# Altium project RP2350_Evaluation.PrjPcb
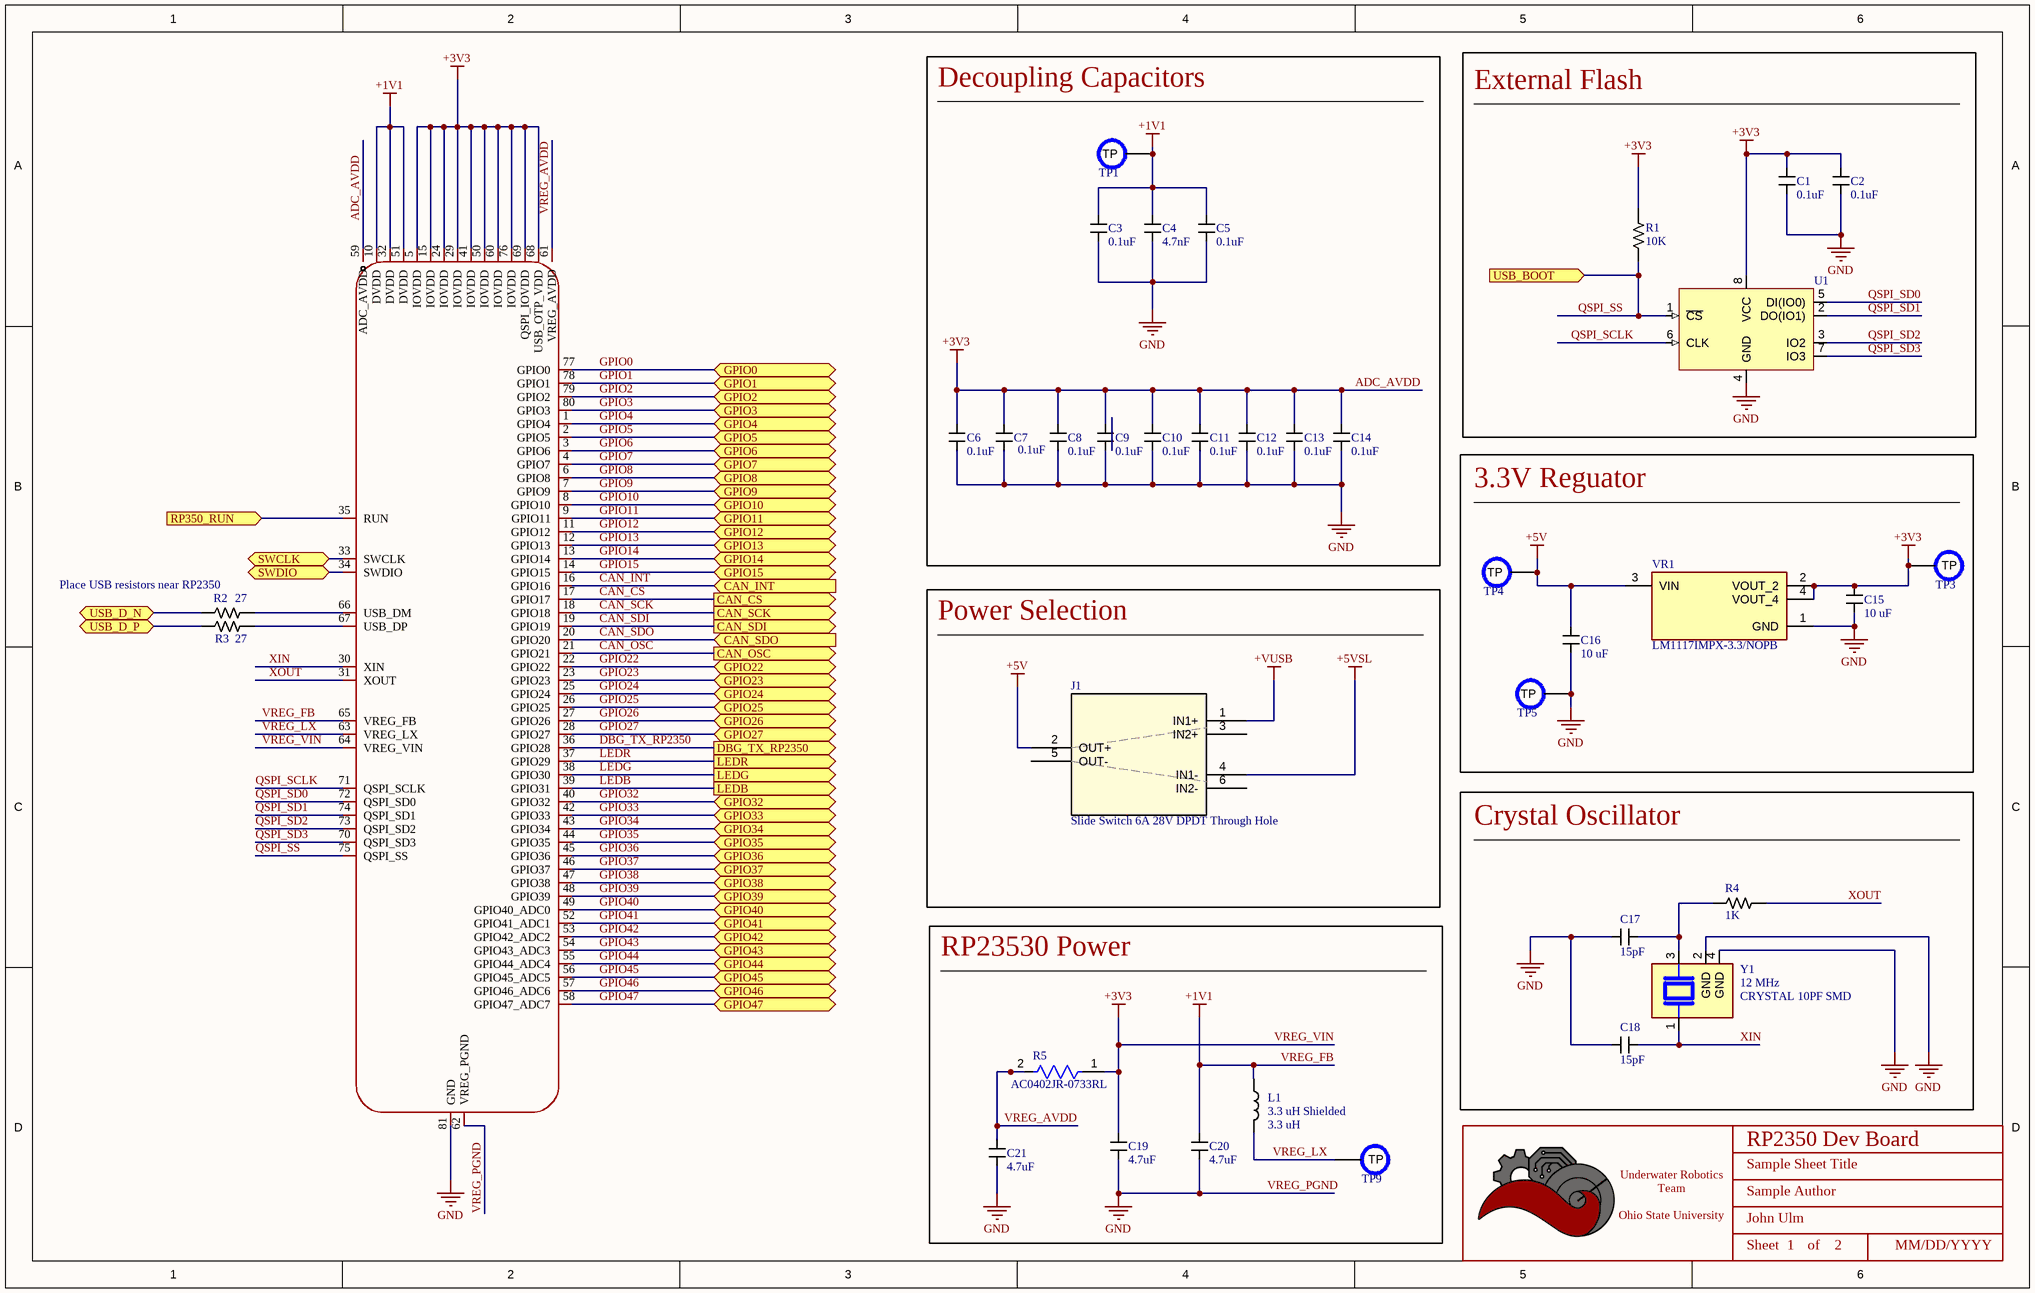
[diagram p0: Micro.SchDoc]
BoardRevision: 1.0; DateOfDesignReview: 01/01/2026; ProjectTitle: RP2350 Dev Board; TeamLead: John Ulm
2 sheets, 71 parts. Net scope: flat (ports and power ports of the same name join across sheets).
Board file: RP2350_DevBoard.PcbDoc
Sheets:
  Micro.SchDoc
  Connectors.SchDoc

## Sheet Micro.SchDoc: Sample Sheet Title
size B; Date: MM/DD/YYYY; Author: Sample Author; Organization: ORGANIZATION; Address1: ADDRESS 1; Address2: ADDRESS 2; Address3: ADDRESS 3; Address4: ADDRESS 4; Revision: -; SheetNumber: 1; SheetTotal: 2; ENG_APP_DATE: --/--/--; DSN_APP_DATE: --/--/--; CHK_APP_DATE: --/--/--

### Parts
(Parts that share a designator on the sheet are numbered #1, #2 ... from top to bottom, then left to right.)
*#1  Title_Block  [LOGO]  (value not drawn)  (graphical)
C1  value 0.1uF  [CAPACITOR_0402]  (hidden comment: 100nF Ceramic 25V)
C2  value 0.1uF  [CAPACITOR_0402]  (hidden comment: 100nF Ceramic 25V)
C3  value 0.1uF  [CAPACITOR_0402]  (hidden comment: 100nF Ceramic 25V)
C4  value 4.7nF  [CAPACITOR_0402]  (hidden comment: 4700pF Ceramic 25V)
C5  value 0.1uF  [CAPACITOR_0402]  (hidden comment: 100nF Ceramic 25V)
C6  value 0.1uF  [CAPACITOR_0402]  (hidden comment: 100nF Ceramic 25V)
C7  value 0.1uF  [CAPACITOR_0402]  (hidden comment: 100nF Ceramic 25V)
C8  value 0.1uF  [CAPACITOR_0402]  (hidden comment: 100nF Ceramic 25V)
C9  value 0.1uF  [CAPACITOR_0402]  (hidden comment: 100nF Ceramic 25V)
C10  value 0.1uF  [CAPACITOR_0402]  (hidden comment: 100nF Ceramic 25V)
C11  value 0.1uF  [CAPACITOR_0402]  (hidden comment: 100nF Ceramic 25V)
C12  value 0.1uF  [CAPACITOR_0402]  (hidden comment: 100nF Ceramic 25V)
C13  value 0.1uF  [CAPACITOR_0402]  (hidden comment: 100nF Ceramic 25V)
C14  value 0.1uF  [CAPACITOR_0402]  (hidden comment: 100nF Ceramic 25V)
C15  Value (uF): 10 uF  [CAPACITOR_0603]  (hidden comment: 10uF Ceramic 6.3V)
C16  Value (uF): 10 uF  [CAPACITOR_0603]  (hidden comment: 10uF Ceramic 6.3V)
C17  value 15pF  [CAPACITOR_0402]  (hidden comment: 15pF Ceramic 50V)
C18  value 15pF  [CAPACITOR_0402]  (hidden comment: 15pF Ceramic 50V)
C19  value 4.7uF  [CAPACITOR_0603]  (hidden comment: 4.7uF Ceramic 6.3V)
C20  value 4.7uF  [CAPACITOR_0603]  (hidden comment: 4.7uF Ceramic 6.3V)
C21  value 4.7uF  [CAPACITOR_0603]  (hidden comment: 4.7uF Ceramic 6.3V)
J1  Slide Switch 6A 28V DPDT Through Hole  [CONN_S3CQE2]
L1  3.3 uH Shielded  value 3.3 uH  [INDUCTOR_0806]
R1  Value  (Ohms): 10K  [RESISTOR_0603]  (hidden comment: 10k Ohm 0.5% 1/10W)
R2  Value  (Ohms): 27  [RESISTOR_0402]  (hidden comment: 27 Ohm 1% 1/16W)
R3  Value  (Ohms): 27  [RESISTOR_0402]  (hidden comment: 27 Ohm 1% 1/16W)
R4  Value  (Ohms): 1K  [RESISTOR_0402]  (hidden comment: 1k Ohm 1% 1/16W)
R5  AC0402JR-0733RL  [FP-AC0402-IPC_C]
TP1  PCB Test Point  [TESTPOINT_1.2MM]  (value not drawn)  (no BOM)
TP3  PCB Test Point  [TESTPOINT_1.2MM]  (value not drawn)  (no BOM)
TP4  PCB Test Point  [TESTPOINT_1.2MM]  (value not drawn)  (no BOM)
TP5  PCB Test Point  [TESTPOINT_1.2MM]  (value not drawn)  (no BOM)
TP9  PCB Test Point  [TESTPOINT_1.2MM]  (value not drawn)  (no BOM)
U1  W25Q128JVSIQ  [SOIC-8 W25QxJV]  (value not drawn)
U2  RP2350B  [QFN-80]  (value not drawn)
VR1  LM1117IMPX-3.3/NOPB  [SOT-223-4]
Y1  CRYSTAL 10PF SMD  value 12 MHz  [4-SMD, NO LEAD CRYSTAL 3.2x2.5mm]

### Blocks framed on the sheet
Decoupling Capacitors: C3-C14 TP1
External Flash: C1 C2 R1 U1
3.3V Reguator: C15 C16 TP3-TP5 VR1
Power Selection: J1
Crystal Oscillator: C17 C18 R4 Y1
RP23530 Power: C19-C21 L1 R5 TP9

### Ports
CAN_CS (out), CAN_INT (in), CAN_OSC (out), CAN_SCK (out), CAN_SDI (out), CAN_SDO (in), DBG_TX_RP2350 (out), GPIO0 (bidir), GPIO1 (bidir), GPIO2 (bidir), GPIO3 (bidir), GPIO4 (bidir), GPIO5 (bidir), GPIO6 (bidir), GPIO7 (bidir), GPIO8 (bidir), GPIO9 (bidir), GPIO10 (bidir), GPIO11 (bidir), GPIO12 (bidir), GPIO13 (bidir), GPIO14 (bidir), GPIO15 (bidir), GPIO22 (bidir), GPIO23 (bidir), GPIO24 (bidir), GPIO25 (bidir), GPIO26 (bidir), GPIO27 (bidir), GPIO32 (bidir), GPIO33 (bidir), GPIO34 (bidir), GPIO35 (bidir), GPIO36 (bidir), GPIO37 (bidir), GPIO38 (bidir), GPIO39 (bidir), GPIO40 (bidir), GPIO41 (bidir), GPIO42 (bidir), GPIO43 (bidir), GPIO44 (bidir), GPIO45 (bidir), GPIO46 (bidir), GPIO47 (bidir), LEDB (out), LEDG (out), LEDR (out), RP350_RUN (in), SWCLK (bidir), SWDIO (bidir), USB_BOOT (in), USB_D_N (bidir), USB_D_P (bidir)

### Nets
+5V: C16.1 J1.2(OUT+) TP4.TP VR1.3(VIN)
+5VSL: J1.4(IN1-)
+VUSB: J1.1(IN1+)
ADC_AVDD: C1.1 C2.1 C6.1 C7.1 C8.1 C9.1 C10.1 C11.1 C12.1 C13.1 C14.1 C15.1 C19.1 R1.1 R5.1 TP3.TP U1.8(VCC) U2.5(IOVDD) U2.15(IOVDD) U2.24(IOVDD) U2.29(IOVDD) U2.41(IOVDD) U2.50(IOVDD) U2.59(ADC_AVDD) U2.60(IOVDD) U2.64(VREG_VIN) U2.68(USB_OTP_VDD) U2.69(QSPI_IOVDD) U2.76(IOVDD) VR1.2(VOUT_2) VR1.4(VOUT_4)  [also labelled +3V3, VREG_VIN]
VREG_FB: C3.1 C4.1 C5.1 C20.2 L1.2 TP1.TP U2.10(DVDD) U2.32(DVDD) U2.51(DVDD) U2.65(VREG_FB)  [also labelled +1V1]
VREG_PGND: C1.2 C2.2 C3.2 C4.2 C5.2 C6.2 C7.2 C8.2 C9.2 C10.2 C11.2 C12.2 C13.2 C14.2 C15.2 C16.2 C17.2 C18.2 C19.2 C20.1 C21.2 TP5.TP U1.4(GND) U2.62(VREG_PGND) U2.81(GND) VR1.1(GND) Y1.2(GND) Y1.4(GND)  [also labelled GND]
CAN_CS: U2.17(GPIO17) ; port CAN_CS
CAN_INT: U2.16(GPIO16) ; port CAN_INT
CAN_OSC: U2.21(GPIO21) ; port CAN_OSC
CAN_SCK: U2.18(GPIO18) ; port CAN_SCK
CAN_SDI: U2.19(GPIO19) ; port CAN_SDI
CAN_SDO: U2.20(GPIO20) ; port CAN_SDO
DBG_TX_RP2350: U2.36(GPIO28) ; port DBG_TX_RP2350
GPIO0: U2.77(GPIO0) ; port GPIO0
GPIO1: U2.78(GPIO1) ; port GPIO1
GPIO2: U2.79(GPIO2) ; port GPIO2
GPIO3: U2.80(GPIO3) ; port GPIO3
GPIO4: U2.1(GPIO4) ; port GPIO4
GPIO5: U2.2(GPIO5) ; port GPIO5
GPIO6: U2.3(GPIO6) ; port GPIO6
GPIO7: U2.4(GPIO7) ; port GPIO7
GPIO8: U2.6(GPIO8) ; port GPIO8
GPIO9: U2.7(GPIO9) ; port GPIO9
GPIO10: U2.8(GPIO10) ; port GPIO10
GPIO11: U2.9(GPIO11) ; port GPIO11
GPIO12: U2.11(GPIO12) ; port GPIO12
GPIO13: U2.12(GPIO13) ; port GPIO13
GPIO14: U2.13(GPIO14) ; port GPIO14
GPIO15: U2.14(GPIO15) ; port GPIO15
GPIO22: U2.22(GPIO22) ; port GPIO22
GPIO23: U2.23(GPIO23) ; port GPIO23
GPIO24: U2.25(GPIO24) ; port GPIO24
GPIO25: U2.26(GPIO25) ; port GPIO25
GPIO26: U2.27(GPIO26) ; port GPIO26
GPIO27: U2.28(GPIO27) ; port GPIO27
GPIO32: U2.40(GPIO32) ; port GPIO32
GPIO33: U2.42(GPIO33) ; port GPIO33
GPIO34: U2.43(GPIO34) ; port GPIO34
GPIO35: U2.44(GPIO35) ; port GPIO35
GPIO36: U2.45(GPIO36) ; port GPIO36
GPIO37: U2.46(GPIO37) ; port GPIO37
GPIO38: U2.47(GPIO38) ; port GPIO38
GPIO39: U2.48(GPIO39) ; port GPIO39
GPIO40: U2.49(GPIO40_ADC0) ; port GPIO40
GPIO41: U2.52(GPIO41_ADC1) ; port GPIO41
GPIO42: U2.53(GPIO42_ADC2) ; port GPIO42
GPIO43: U2.54(GPIO43_ADC3) ; port GPIO43
GPIO44: U2.55(GPIO44_ADC4) ; port GPIO44
GPIO45: U2.56(GPIO45_ADC5) ; port GPIO45
GPIO46: U2.57(GPIO46_ADC6) ; port GPIO46
GPIO47: U2.58(GPIO47_ADC7) ; port GPIO47
LEDB: U2.39(GPIO31) ; port LEDB
LEDG: U2.38(GPIO30) ; port LEDG
LEDR: U2.37(GPIO29) ; port LEDR
QSPI_SCLK: U1.6(CLK) U2.71(QSPI_SCLK)
QSPI_SD0: U1.5(DI(IO0)) U2.72(QSPI_SD0)
QSPI_SD1: U1.2(DO(IO1)) U2.74(QSPI_SD1)
QSPI_SD2: U1.3(IO2) U2.73(QSPI_SD2)
QSPI_SD3: U1.7(IO3) U2.70(QSPI_SD3)
QSPI_SS: R1.2 U1.1(~{CS}) U2.75(QSPI_SS) ; port USB_BOOT
USB_D_N: R2.2 ; port USB_D_N
USB_D_P: R3.2 ; port USB_D_P
VREG_AVDD: C21.1 R5.2 U2.61(VREG_AVDD)
VREG_LX: L1.1 TP9.TP U2.63(VREG_LX)
XIN: C18.1 U2.30(XIN) Y1.1
XOUT: R4.1 U2.31(XOUT)
NetC17_1: C17.1 R4.2 Y1.3
NetJ7_1: U2.34(SWDIO) ; port SWDIO
NetJ7_3: U2.33(SWCLK) ; port SWCLK
NetJ7_4: U2.35(RUN) ; port RP350_RUN
NetR2_1: R2.1 U2.66(USB_DM)
NetR3_1: R3.1 U2.67(USB_DP)

Not connected (* = marked no-connect by the designer): J1 3(IN2+) 5(OUT-) 6(IN2-)

### Notes on the sheet
- Place USB resistors near RP2350
- Labels drawn without touching a wire or pin: \
- DWG. NO.
- REV.
- SHT.
- THIS DOCUMENT AND THE DATA DISCLOSED HEREIN OR HEREWITH IS THE PROPERTY OF ALTIUM LIMITED AND MAY BE FREELY DISTRIBUTED IN WHOLE. NO RIGHTS ARE RESERVED OR EXPRESS OR IMPLIED WARANTEE GIVEN.
- REVISION
- DESCRIPTION
- DATE
- APPROVED
- ENG:
- APPROVALS
- PROJECT
- DSN:
- CHK:
- REFERENCE DOCUMENTS
- PROJECT REVISION:
- TITLE
- DOCUMENT REVISION:
- DESIGN ITEM:
- BOM:
- FAB DWG:
- PCB DWG:
- ASSY DWG:
- SCALE:
- SIZE
- B
- CAGE CODE
- FILE NAME
- DWG NO.
- SHEET
- OF
- REV
- (in symbol Title_Block) Underwater Robotics Team / Ohio State University; Sheet; of

### Library data of the parts
*#1 = Title_Block: UWRT Schematic Title Block Template / Created June 2021, Dylan Trainor
C1-C3 C5-C14 = CAPACITOR_0.1uF_0402: Cap 100nF 25V +/-10% / Ceramic 0402; Made By: Robert Pafford; Tolerance: +/- 10%; Voltage: 25V; Supplier 1: Future Electronics; Supplier Part Number 1: 7029569
C4 = CAPACITOR_0.0047uF_0402: 4700 pF +/-10% 25V Ceramic Capacitor X7R 0402; Made By: Robert Pafford; Tolerance: +/- 10%; Voltage: 25V; Supplier 1: Future Electronics; Supplier Part Number 1: 1909415
C15 C16 = CAPACITOR_10uF_0603: Cap 10uF 6.3V +/-20% / Ceramic 0603; Made By: Flip B; ComponentLink1Description: Digikey; ComponentLink1URL: https://www.digikey.com/en/products/detail/samsung-electro-mechanics/CL10A106MQ8NNNC/3886777; Supplier 1: Digi-Key; Supplier Part Number 1: 1276-1119-1-ND; Tolerance: +/- 20%; Voltage: 6.3V
C17 C18 = CAPACITOR_0.000015uF_0402: CAP CER 15PF 50V C0G/NP0 0402; Tolerance: +/- 5%; Made By: Robert Pafford; Voltage: 50V; Supplier 1: Newark; Supplier Part Number 1: 82AC9245
C19-C21 = CAPACITOR_4.7uF_0603: Cap 4.7uF 6.3V +/-10% / Ceramic 0603; Made By: Robert Pafford; Tolerance: +/- 10%; Voltage: 6.3V; Supplier 1: Digi-Key; Supplier Part Number 1: 1276-2087-1-ND
J1 = Slide DPDT Switch: SWITCH SLIDE DPDT 6A 28V Through Hole; Mfr_Name: C&K; Manufacturer_Part_Number: 1201M2S3CQE2; Copyright: Copyright (C) 2022 Ultra Librarian. All rights reserved.; RefDes: RefDes; Type: DEV; Supplier 1: Newark; Supplier Part Number 1: 36AH1005
L1 = INDUCTOR_3.3uH_0806: 3.3 µH Shielded Molded Inductor 2.1 A 140mOhm Max 0806 (2016 Metric); Manufacturer: Abracon LLC; Supplier 1: DigiKey; Supplier Part Number 1: 535-AOTA-B201610S3R3-101-TDKR-ND; Created By: John Ulm
R1 = RESISTOR_10K_0.5%_0603: RES 10k OHM 0.5% 1/10W 0603; Tolerance: +/- 0.5%; Made By: Robert Pafford; Wattage: 1/10W; Supplier: Digikey; Digikey Part Numer: CR0603-JW-104ELFTR-ND; Supplier 1: Digi-Key; Supplier Part Number 1: 749-1695-1-ND
R2 R3 = RESISTOR_27_0402: RES 27 OHM 1% 1/16W 0402; Tolerance: +/- 1%; Made By: Robert Pafford; Wattage: 1/16W; Supplier: Digikey; Digikey Part Numer: CR0603-JW-104ELFTR-ND; Supplier 1: Digi-Key; Supplier Part Number 1: YAG5278DKR-ND
R4 = RESISTOR_1K_0402: RES 1k OHM 1% 1/16W 0402; Tolerance: +/- 1%; Made By: Robert Pafford; Wattage: 1/16W; Supplier: Digikey; Digikey Part Numer: CR0603-JW-104ELFTR-ND; Supplier 1: Digi-Key; Supplier Part Number 1: 13-AC0402FR-131KLCT-ND
R5 = CMP-03412-045460-1: RES 33Ω ±5% 0.063W 0402; Resistance: 33R; Voltage Rating: 50V; Power Rating: 62.5mW; Temperature Coefficient: 100ppm/°C; Max Power Dissipation: 63mW; Width: 0.5mm; Max Operating Temperature: 155°C; Termination: SMD/SMT; Size Code: 0402; Lead Free: Lead Free; Series: AC; Case Code (Imperial): 0402; RoHS Compliant: Yes; Packaging: Tape and Reel; Features: Moisture Resistant; Case/Package: 0402; Height: 0.015inch; Length: 0.039inch; Number of Terminations: 2; Case Code (Metric): 1005; Tolerance: 5%; Min Operating Temperature: -55°C; Weight: 2.3E-05oz; Resistor Type: Thick Film
TP1 TP3-TP5 TP9 = TESTPOINT: Made By: Robert Pafford
U1 = W25Q128JVSIQ: IC FLASH 128MBIT SPI/QUAD 8SOIC; Made By: Robert Pafford; Supplier 1: Digi-Key; Supplier Part Number 1: W25Q128JVSIQ-ND; Size: 128M
U2 = RP2350B_C42415655: Manufacturer: Raspberry Pi(树莓派); Add into BOM: yes; Symbol: RP2350B_C42415655; Device: RP2350B_C42415655; LCSC Part Name: 微控制器; Supplier Part: C42415655; Manufacturer Part: RP2350B; Supplier Footprint: QFN-80-EP(10x10); JLCPCB Part Class: Extended Part; Datasheet: https://item.szlcsc.com/datasheet/RP2350B/44413055.html; Supplier: LCSC; Convert to PCB: yes
VR1 = LM1117IMPX-3.3/NOPB: 800-mA 15-V linear voltage regulator 4-SOT-223 -40 to 125; MF: Texas Instruments; Texas_Instruments-Purchase-URL: https://snapeda.com/shop?store=Texas+Instruments&id=410186; Price: None; Mouser-Purchase-URL: https://snapeda.com/shop?store=Mouser&id=410186; MP: LM1117IMPX-3.3/NOPB; Value: *; Availability: Good; Package: SOT-223-4 Texas Instruments; Arrow_Electronics-Purchase-URL: https://snapeda.com/shop?store=Arrow+Electronics&id=410186; SnapEDA_Link: https://www.snapeda.com/parts/LM1117IMPX-3.3/NOPB/Texas%20Instruments/view-part/410186/?ref=snap; DigiKey-Purchase-URL: https://snapeda.com/shop?store=DigiKey&id=410186
Y1 = CRYSTAL_12MHz_RP2350: 12 MHz ±30ppm Crystal 10pF 50 Ohms 4-SMD, No Lead; Supplier 1: DigiKey; Supplier Part Number 1: 535-ABM8-272-T3CT-ND; Created By: John Ulm

## Sheet Connectors.SchDoc: Sample Sheet Title
size B; Date: MM/DD/YYYY; Author: Sample Author; Organization: ORGANIZATION; Address1: ADDRESS 1; Address2: ADDRESS 2; Address3: ADDRESS 3; Address4: ADDRESS 4; Revision: -; SheetNumber: 2; SheetTotal: 2; ENG_APP_DATE: --/--/--; DSN_APP_DATE: --/--/--; CHK_APP_DATE: --/--/--
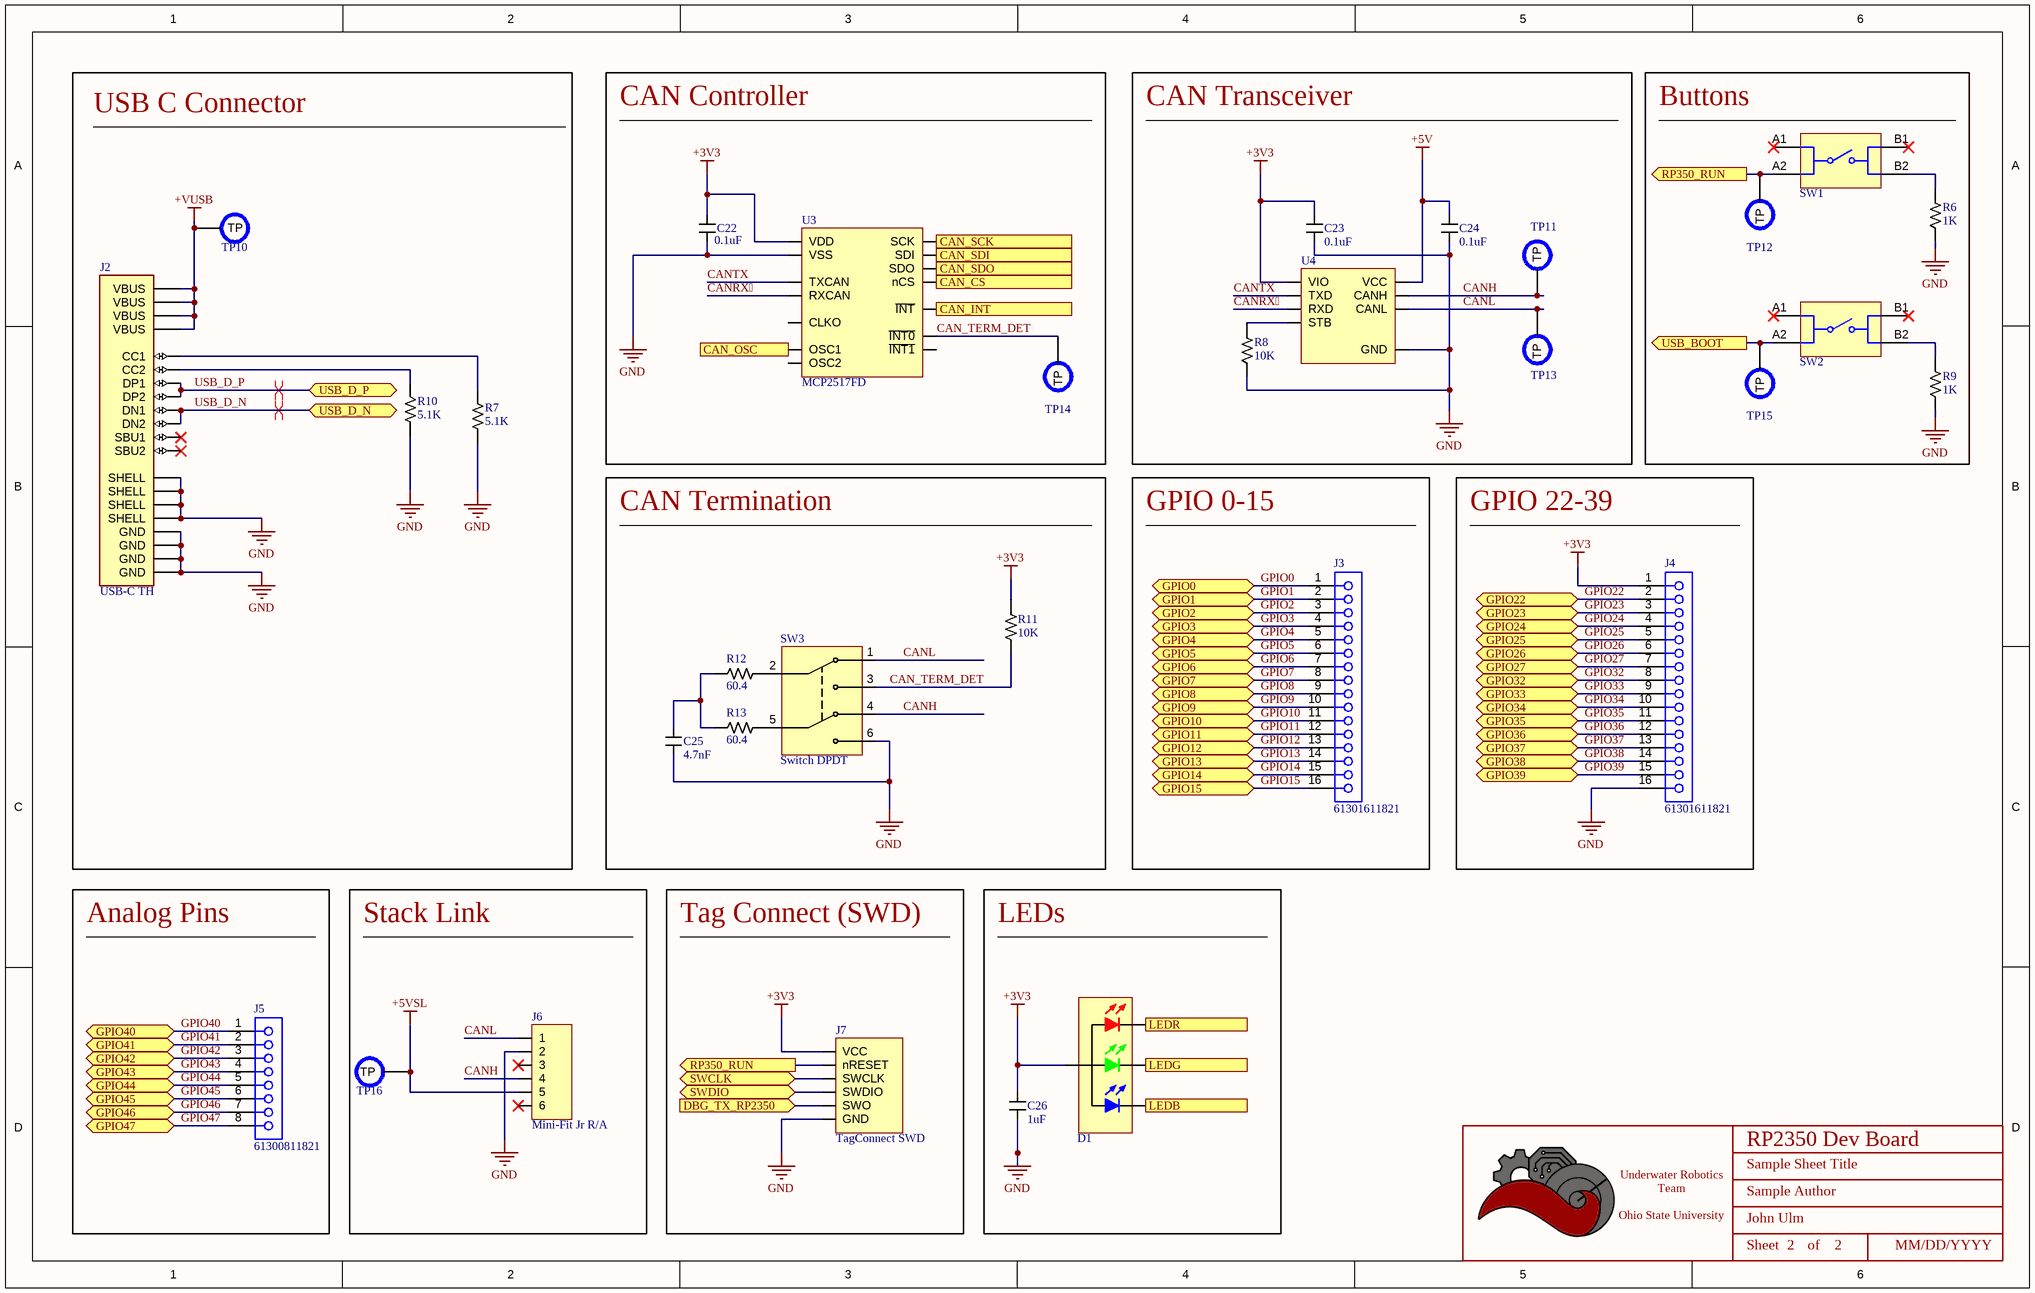
[diagram p1: Connectors.SchDoc]

### Parts
(Parts that share a designator on the sheet are numbered #1, #2 ... from top to bottom, then left to right.)
*#2  Title_Block  [LOGO]  (value not drawn)  (graphical)
C22  value 0.1uF  [CAPACITOR_0603]  (hidden comment: 100nF Ceramic 25V)
C23  value 0.1uF  [CAPACITOR_0603]  (hidden comment: 100nF Ceramic 25V)
C24  value 0.1uF  [CAPACITOR_0603]  (hidden comment: 100nF Ceramic 25V)
C25  value 4.7nF  [CAPACITOR_0402]  (hidden comment: 4700pF Ceramic 25V)
C26  value 1uF  [CAPACITOR_0603]  (hidden comment: 1uF Ceramic 16V)
D1  EAST1616RGBB4  [LED_0606_4SMD]  (value not drawn)
J2  USB-C TH  [USB-C TH]
J3  61301611821  [61301611821]
J4  61301611821  [61301611821]
J5  61300811821  [61300811821]
J6  Mini-Fit Jr R/A  [CONN_MOLEX_MINIFIT JR_6 POS_R/A]
J7  TagConnect SWD  [TC2030-MCP]  (no BOM)
R6  Value  (Ohms): 1K  [RESISTOR_0603]  (hidden comment: 1k Ohm 5% 1/8W)
R7  Value  (Ohms): 5.1K  [RESISTOR_0805]  (hidden comment: 5.1k Ohm 1% 1/8W)
R8  Value  (Ohms): 10K  [RESISTOR_0402]  (hidden comment: 10k Ohm 1% 1/16W)
R9  Value  (Ohms): 1K  [RESISTOR_0603]  (hidden comment: 1k Ohm 5% 1/8W)
R10  Value  (Ohms): 5.1K  [RESISTOR_0805]  (hidden comment: 5.1k Ohm 1% 1/8W)
R11  Value  (Ohms): 10K  [RESISTOR_0402]  (hidden comment: 10k Ohm 1% 1/16W)
R12  Value  (Ohms): 60.4  [RESISTOR_0402]  (hidden comment: 60.4 Ohm 1% 1/16W)
R13  Value  (Ohms): 60.4  [RESISTOR_0402]  (hidden comment: 60.4 Ohm 1% 1/16W)
SW1  434123025826  [SMD_434123025826]  (value not drawn)
SW2  434123025826  [SMD_434123025826]  (value not drawn)
SW3  Switch DPDT  [CAS-220TA]
TP10  PCB Test Point  [TESTPOINT_1.2MM]  (value not drawn)  (no BOM)
TP11  PCB Test Point  [TESTPOINT_1.2MM]  (value not drawn)  (no BOM)
TP12  PCB Test Point  [TESTPOINT_1.2MM]  (value not drawn)  (no BOM)
TP13  PCB Test Point  [TESTPOINT_1.2MM]  (value not drawn)  (no BOM)
TP14  PCB Test Point  [TESTPOINT_1.2MM]  (value not drawn)  (no BOM)
TP15  PCB Test Point  [TESTPOINT_1.2MM]  (value not drawn)  (no BOM)
TP16  PCB Test Point  [TESTPOINT_1.2MM]  (value not drawn)  (no BOM)
U3  MCP2517FD  [SOIC-14]
U4  CAN Transceiver  [SOIC-8]  (value not drawn)

### Blocks framed on the sheet
USB C Connector: J2 R7 R10 TP10
CAN Controller: C22 TP14 U3
CAN Transceiver: C23 C24 R8 TP11 TP13 U4
Buttons: R6 R9 SW1 SW2 TP12 TP15
CAN Termination: C25 R11-R13 SW3
GPIO 0-15: J3
GPIO 22-39: J4
Analog Pins: J5
Stack Link: J6 TP16
Tag Connect (SWD): J7
LEDs: C26 D1

### Ports
CAN_CS (in), CAN_INT (out), CAN_OSC (in), CAN_SCK (in), CAN_SDI (in), CAN_SDO (out), DBG_TX_RP2350 (in), GPIO0 (bidir), GPIO1 (bidir), GPIO2 (bidir), GPIO3 (bidir), GPIO4 (bidir), GPIO5 (bidir), GPIO6 (bidir), GPIO7 (bidir), GPIO8 (bidir), GPIO9 (bidir), GPIO10 (bidir), GPIO11 (bidir), GPIO12 (bidir), GPIO13 (bidir), GPIO14 (bidir), GPIO15 (bidir), GPIO22 (bidir), GPIO23 (bidir), GPIO24 (bidir), GPIO25 (bidir), GPIO26 (bidir), GPIO27 (bidir), GPIO32 (bidir), GPIO33 (bidir), GPIO34 (bidir), GPIO35 (bidir), GPIO36 (bidir), GPIO37 (bidir), GPIO38 (bidir), GPIO39 (bidir), GPIO40 (bidir), GPIO41 (bidir), GPIO42 (bidir), GPIO43 (bidir), GPIO44 (bidir), GPIO45 (bidir), GPIO46 (bidir), GPIO47 (bidir), LEDB (out), LEDG (out), LEDR (out), RP350_RUN (out), SWCLK (bidir), SWDIO (bidir), USB_BOOT (out), USB_D_N (bidir), USB_D_P (bidir)

### Nets
+3V3: C22.1 C23.1 C26.1 D1.4 J4.1 J7.2(VCC) R11.1 U3.14(VDD) U4.5(VIO)  [project net ADC_AVDD]
+5V: C24.1 U4.3(VCC)
+5VSL: J6.5 TP16.TP
+VUSB: J2.A4(VBUS) J2.A9(VBUS) J2.B4(VBUS) J2.B9(VBUS) TP10.TP
GND: C22.2 C23.2 C24.2 C25.2 C26.2 J2.A1(GND) J2.A12(GND) J2.B1(GND) J2.B12(GND) J2.S1(SHELL) J2.S2(SHELL) J2.S3(SHELL) J2.S4(SHELL) J4.16 J6.2 J7.6(GND) R6.2 R7.1 R8.2 R9.2 R10.1 SW3.6 U3.7(VSS) U4.2(GND)  [project net VREG_PGND]
CAN_CS: U3.13(nCS) ; port CAN_CS
CAN_INT: U3.4(~{INT}) ; port CAN_INT
CAN_OSC: U3.6(OSC1) ; port CAN_OSC
CAN_SCK: U3.10(SCK) ; port CAN_SCK
CAN_SDI: U3.11(SDI) ; port CAN_SDI
CAN_SDO: U3.12(SDO) ; port CAN_SDO
CAN_TERM_DET: R11.2 SW3.3 TP14.TP U3.9(~{INT0})
CANH: J6.4 SW3.4 TP11.TP U4.7(CANH)
CANL: J6.1 SW3.1 TP13.TP U4.6(CANL)
CANRX: U3.2(RXCAN) U4.4(RXD)
CANTX: U3.1(TXCAN) U4.1(TXD)
DBG_TX_RP2350: J7.5(SWO) ; port DBG_TX_RP2350
GPIO0: J3.1 ; port GPIO0
GPIO1: J3.2 ; port GPIO1
GPIO2: J3.3 ; port GPIO2
GPIO3: J3.4 ; port GPIO3
GPIO4: J3.5 ; port GPIO4
GPIO5: J3.6 ; port GPIO5
GPIO6: J3.7 ; port GPIO6
GPIO7: J3.8 ; port GPIO7
GPIO8: J3.9 ; port GPIO8
GPIO9: J3.10 ; port GPIO9
GPIO10: J3.11 ; port GPIO10
GPIO11: J3.12 ; port GPIO11
GPIO12: J3.13 ; port GPIO12
GPIO13: J3.14 ; port GPIO13
GPIO14: J3.15 ; port GPIO14
GPIO15: J3.16 ; port GPIO15
GPIO22: J4.2 ; port GPIO22
GPIO23: J4.3 ; port GPIO23
GPIO24: J4.4 ; port GPIO24
GPIO25: J4.5 ; port GPIO25
GPIO26: J4.6 ; port GPIO26
GPIO27: J4.7 ; port GPIO27
GPIO32: J4.8 ; port GPIO32
GPIO33: J4.9 ; port GPIO33
GPIO34: J4.10 ; port GPIO34
GPIO35: J4.11 ; port GPIO35
GPIO36: J4.12 ; port GPIO36
GPIO37: J4.13 ; port GPIO37
GPIO38: J4.14 ; port GPIO38
GPIO39: J4.15 ; port GPIO39
GPIO40: J5.1 ; port GPIO40
GPIO41: J5.2 ; port GPIO41
GPIO42: J5.3 ; port GPIO42
GPIO43: J5.4 ; port GPIO43
GPIO44: J5.5 ; port GPIO44
GPIO45: J5.6 ; port GPIO45
GPIO46: J5.7 ; port GPIO46
GPIO47: J5.8 ; port GPIO47
LEDB: D1.3 ; port LEDB
LEDG: D1.2 ; port LEDG
LEDR: D1.1 ; port LEDR
QSPI_SS: SW2.A2 TP15.TP ; port USB_BOOT
USB_D_N: J2.A7(DN1) J2.B7(DN2) ; port USB_D_N
USB_D_P: J2.A6(DP1) J2.B6(DP2) ; port USB_D_P
NetC25_1: C25.1 R12.2 R13.2
NetJ2_A5: J2.A5(CC1) R7.2
NetJ2_B5: J2.B5(CC2) R10.2
NetJ7_1: J7.1(SWDIO) ; port SWDIO
NetJ7_3: J7.3(SWCLK) ; port SWCLK
NetJ7_4: J7.4(nRESET) SW1.A2 TP12.TP ; port RP350_RUN
NetR6_1: R6.1 SW1.B2
NetR8_1: R8.1 U4.8(STB)
NetR9_1: R9.1 SW2.B2
NetR12_1: R12.1 SW3.2
NetR13_1: R13.1 SW3.5

Not connected (* = marked no-connect by the designer): J2 A8(SBU1)* B8(SBU2)*; J6 3* 6*; SW1 A1* B1*; SW2 A1* B1*; U3 3(CLKO) 5(OSC2) 8(~{INT1})

### Layout directives
differential pair: USB_D_N, USB_D_P

### Notes on the sheet
- DWG. NO.
- REV.
- SHT.
- THIS DOCUMENT AND THE DATA DISCLOSED HEREIN OR HEREWITH IS THE PROPERTY OF ALTIUM LIMITED AND MAY BE FREELY DISTRIBUTED IN WHOLE. NO RIGHTS ARE RESERVED OR EXPRESS OR IMPLIED WARANTEE GIVEN.
- REVISION
- DESCRIPTION
- DATE
- APPROVED
- ENG:
- APPROVALS
- PROJECT
- DSN:
- CHK:
- REFERENCE DOCUMENTS
- PROJECT REVISION:
- TITLE
- DOCUMENT REVISION:
- DESIGN ITEM:
- BOM:
- FAB DWG:
- PCB DWG:
- ASSY DWG:
- SCALE:
- SIZE
- B
- CAGE CODE
- FILE NAME
- DWG NO.
- SHEET
- OF
- REV
- (in symbol Title_Block) Underwater Robotics Team / Ohio State University; Sheet; of

### Library data of the parts
*#2 = Title_Block: as *#1 on sheet Micro
C22-C24 = CAPACITOR_0.1uF_0603_25V: Cap 100nF 25V +/-10% / Ceramic 0603; Voltage: 6.3V; Made By: Flip B; ComponentLink1Description: Datsheet; ComponentLink1URL: https://www.mouser.com/datasheet/2/212/KEM_C1002_X7R_SMD-1102033.pdf; Tolerance: +/- 10%; Supplier 1: Digikey; Supplier Part Number 1: 1276-1006-1-ND
C25 = CAPACITOR_0.0047uF_0402: as C4 on sheet Micro; Tolerance: +/- 10%; Voltage: 25V; Supplier 1: Future Electronics; Supplier Part Number 1: 1909415
C26 = CAPACITOR_1uF_0603: Cap 1uF 16V +/-10% / Ceramic 0603; Made By: Flip B; Tolerance: +/- 10%; Voltage: 16V; Supplier 1: Arrow Electronics; Supplier Part Number 1: C1608X7R1C105K080AC
D1 = LED_RGB_4SMD: LED RGB CLEAR 4SMD; Made By: Robert Pafford; Red Forward Voltage: 1.8V; Red Forward Current: 5mA; Green Forward Voltage: 2.8V; ComponentLink1Description: Datasheet; ComponentLink1URL: https://everlightamericas.com/index.php?controller=attachment&id_attachment=3220; Package: 4-SMD; Green Forward Current: 5mA; Blue Forward Voltage: 2.8V; Blue Forward Current: 5mA; Color: RGB; Supplier 1: Digi-Key; Supplier Part Number 1: 1080-1552-1-ND
J2 = CONN_USBC_USB4085-GF-A: USB-C (USB TYPE-C) USB 2.0 Receptacle Connector 24 (16+8 Dummy) Position Through Hole, Right Angle; Supplier 1: DigiKey; Supplier Part Number 1: 2073-USB4085-GF-ADKR-ND; Created By: John Ulm; Type: Through Hole; Interface: USB-C
J3 J4 = CMP-1502-01343-3: NexarPartId: 23389750; Operating Supply Voltage: 250V; Contact Resistance: 20mΩ; Current Rating: 3A; Gender: Female; Number of Pins: 16; Orientation: Vertical; Contact Material: Copper; Lead Free: Lead Free; Lead Pitch: 2.54mm; RoHS: Compliant
J5 = CMP-1502-01327-3: NexarPartId: 61924723; Current Rating: 3A; Gender: Female; Contact Resistance: 20mΩ; Operating Supply Voltage: 250V; Lead Pitch: 2.54mm; RoHS: Non-Compliant; Orientation: Vertical; Number of Pins: 8
J6 = CONN_MOLEX_MINIFIT JR_6POS_R/A: Molex Minifit Jr. 5569 / 6 Pos R/A Natural; Pitch: 4.2mm; Configuration: Right Angle; Current Per Pin: 13A; Number of Positions: 8; Manufacturer: Molex; Color: Natural; Created By: Flip B; ComponentLink1Description: Datasheet; ComponentLink1URL: https://www.molex.com/pdm_docs/ps/PS-5556-001.pdf; Series: Minifit Jr 5569; Supplier 1: Digi-Key; Supplier Part Number 1: WM1353-ND
J7 = TC2030_SWD: TagConnect TC2030 ARM SWD 6-pin
R6 R9 = RESISTOR_1K_0603: RES 1k OHM 5% 1/8W 0603; Tolerance: +/- 5%; Made By: Robert Pafford; ComponentLink1Description: Datasheet; ComponentLink1URL: https://www.bourns.com/docs/product-datasheets/CRxxxxx.pdf; Wattage: 1/8W; Supplier: Digikey; Digikey Part Numer: CR0603-JW-104ELFTR-ND; Supplier 1: Digi-Key; Supplier Part Number 1: 2019-RK73B1JTTD102JCT-ND
R7 R10 = RESISTOR_5.1K_0805: RES 5.1k OHM 1% 1/8W 0805; Tolerance: +/- 5%; Made By: Dylan Trainor; ComponentLink1Description: Datasheet; ComponentLink1URL: https://www.bourns.com/docs/product-datasheets/CRxxxxx.pdf; Wattage: 1/8W; Supplier: Digikey; Digikey Part Numer: CR0603-JW-104ELFTR-ND; Supplier 1: Newark; Supplier Part Number 1: 53W4863
R8 R11 = RESISTOR_10K_0402: RES 10k OHM 1% 1/16W 0402; Tolerance: +/- 1%; Made By: Robert Pafford; Wattage: 1/16W; Supplier: Digikey; Digikey Part Numer: CR0603-JW-104ELFTR-ND; Supplier 1: Digi-Key; Supplier Part Number 1: YAG3436CT-ND
R12 R13 = RESISTOR_60.4_0402: RES 60.4 OHM 1% 1/16W 0402; Tolerance: +/- 1%; Made By: Robert Pafford; Wattage: 1/16W; Supplier: Digikey; Digikey Part Numer: CR0603-JW-104ELFTR-ND; Supplier 1: Digi-Key; Supplier Part Number 1: 13-AC0402FR-0760R4LCT-ND
SW1 SW2 = Tactile Switch SMD: WS-TASV J-Bend SMT Tact Switch, SPST-NO, 16VDC, 50mA, 260g; Manufacturer: Wurth Elektronik; Washable: No; ComponentLink1Description: Website Link; ComponentLink1URL: https://www.we-online.com/redexpert/article/434123025826?ad; ComponentLink2Description: Datasheet Link; ComponentLink2URL: https://www.we-online.com/redexpert/spec/434123025826?ad; Manufacturer Part Number: 434123025826; Category: Tact Switches; Match Code: WS-TASV; Mount: Surface Mount; Operating Temperature Max: 85°C; Operating Temperature Min: -40°C; Packaging: Tape and Reel; Length: 4.2mm; Width: 3.2mm; Height: 2.5mm; Circuit: SPST-NO; Contact Material: Stainless Steel; Contact Plating: Silver; Operation Force: 260g; Rated Current: 50mA; Rated Voltage: 16VDC; Terminal Material: Copper Alloy; Terminal Plating: Silver; Supplier 1: Mouser; Supplier Part Number 1: 710-434123025826
SW3 = CAS-220TA_CAN_TERM: GOLD SWITCH FLUSH SLIDE DPDT 100MA 6V; Made By: Robert Pafford; Voltage Rating: 6VDC; Current Rating: 100 mA; Switch Function: DPDT; Contact Finish: Gold; Supplier 1: Digi-Key; Supplier Part Number 1: CAS220JCT-ND
TP10-TP16 = TESTPOINT: Made By: Robert Pafford
U3 = MCP2517FD: CANbus Controller CAN 2.0 SPI Interface 14-SOIC; Made By: Robert Pafford; Max FD Rate: 8 Mbps
U4 = TJA1442AT: CAN Interface IC High-Speed CAN Transceiver with Standby Mode; Made By: Robert Pafford; Max Data Rate: 5Mbps; Supplier 1: Mouser; Supplier Part Number 1: 771-TJA1442AT/0Z

## Nets that join several sheets
+5V: Micro (C16.1 J1.2 TP4.TP VR1.3), Connectors (C24.1 U4.3)
+5VSL: Micro (J1.4), Connectors (J6.5 TP16.TP)
+VUSB: Micro (J1.1), Connectors (5 pins)
ADC_AVDD: Micro (31 pins), Connectors (9 pins)
VREG_PGND: Micro (28 pins), Connectors (24 pins)
CAN_CS: Micro (U2.17), Connectors (U3.13)
CAN_INT: Micro (U2.16), Connectors (U3.4)
CAN_OSC: Micro (U2.21), Connectors (U3.6)
CAN_SCK: Micro (U2.18), Connectors (U3.10)
CAN_SDI: Micro (U2.19), Connectors (U3.11)
CAN_SDO: Micro (U2.20), Connectors (U3.12)
DBG_TX_RP2350: Micro (U2.36), Connectors (J7.5)
GPIO0: Micro (U2.77), Connectors (J3.1)
GPIO1: Micro (U2.78), Connectors (J3.2)
GPIO2: Micro (U2.79), Connectors (J3.3)
GPIO3: Micro (U2.80), Connectors (J3.4)
GPIO4: Micro (U2.1), Connectors (J3.5)
GPIO5: Micro (U2.2), Connectors (J3.6)
GPIO6: Micro (U2.3), Connectors (J3.7)
GPIO7: Micro (U2.4), Connectors (J3.8)
GPIO8: Micro (U2.6), Connectors (J3.9)
GPIO9: Micro (U2.7), Connectors (J3.10)
GPIO10: Micro (U2.8), Connectors (J3.11)
GPIO11: Micro (U2.9), Connectors (J3.12)
GPIO12: Micro (U2.11), Connectors (J3.13)
GPIO13: Micro (U2.12), Connectors (J3.14)
GPIO14: Micro (U2.13), Connectors (J3.15)
GPIO15: Micro (U2.14), Connectors (J3.16)
GPIO22: Micro (U2.22), Connectors (J4.2)
GPIO23: Micro (U2.23), Connectors (J4.3)
GPIO24: Micro (U2.25), Connectors (J4.4)
GPIO25: Micro (U2.26), Connectors (J4.5)
GPIO26: Micro (U2.27), Connectors (J4.6)
GPIO27: Micro (U2.28), Connectors (J4.7)
GPIO32: Micro (U2.40), Connectors (J4.8)
GPIO33: Micro (U2.42), Connectors (J4.9)
GPIO34: Micro (U2.43), Connectors (J4.10)
GPIO35: Micro (U2.44), Connectors (J4.11)
GPIO36: Micro (U2.45), Connectors (J4.12)
GPIO37: Micro (U2.46), Connectors (J4.13)
GPIO38: Micro (U2.47), Connectors (J4.14)
GPIO39: Micro (U2.48), Connectors (J4.15)
GPIO40: Micro (U2.49), Connectors (J5.1)
GPIO41: Micro (U2.52), Connectors (J5.2)
GPIO42: Micro (U2.53), Connectors (J5.3)
GPIO43: Micro (U2.54), Connectors (J5.4)
GPIO44: Micro (U2.55), Connectors (J5.5)
GPIO45: Micro (U2.56), Connectors (J5.6)
GPIO46: Micro (U2.57), Connectors (J5.7)
GPIO47: Micro (U2.58), Connectors (J5.8)
LEDB: Micro (U2.39), Connectors (D1.3)
LEDG: Micro (U2.38), Connectors (D1.2)
LEDR: Micro (U2.37), Connectors (D1.1)
NetJ7_1: Micro (U2.34), Connectors (J7.1)
NetJ7_3: Micro (U2.33), Connectors (J7.3)
NetJ7_4: Micro (U2.35), Connectors (J7.4 SW1.A2 TP12.TP)
QSPI_SS: Micro (R1.2 U1.1 U2.75), Connectors (SW2.A2 TP15.TP)
USB_D_N: Micro (R2.2), Connectors (J2.A7 J2.B7)
USB_D_P: Micro (R3.2), Connectors (J2.A6 J2.B6)